# Altium schematic sheet SD.SchDoc
size A4
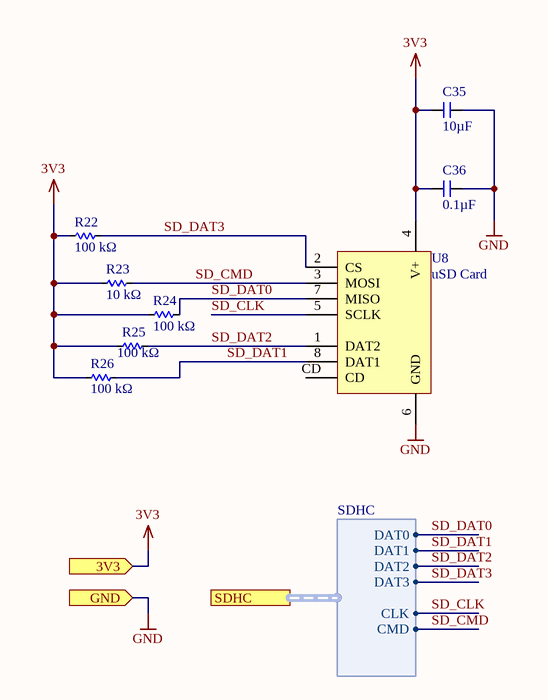
[diagram p0: SD.SchDoc]

## Parts
C35  Capacitance (shorthand): 10µF  [C0603]  (hidden comment: __template_cap)
C36  Capacitance (shorthand): 0.1µF  [C0603]  (hidden comment: __template_cap)
R22  Resistance: 100 kΩ  [R0603]  (hidden comment: __template_resistor)
R23  Resistance: 10 kΩ  [R0603]  (hidden comment: __template_resistor)
R24  Resistance: 100 kΩ  [R0603]  (hidden comment: __template_resistor)
R25  Resistance: 100 kΩ  [R0603]  (hidden comment: __template_resistor)
R26  Resistance: 100 kΩ  [R0603]  (hidden comment: __template_resistor)
U8  uSD Card  [MICROSD_CARD_SOCKET]

## Ports
3V3 (in), GND (in), SDHC (harness SDHC)

## Harnesses
SDHC: DAT3, DAT0, DAT2, DAT1, CLK, CMD

## Nets
3V3: C35.2 C36.1 R22.1 R23.1 R24.1 R25.1 R26.1 U8.4(V+) ; port 3V3
GND: C35.1 C36.2 U8.6(GND) ; port GND
SD_CLK: U8.5(SCLK) ; port SDHC.CLK
SD_CMD: R23.2 U8.3(MOSI) ; port SDHC.CMD
SD_DAT0: R24.2 U8.7(MISO) ; port SDHC.DAT0
SD_DAT1: R26.2 U8.8(DAT1) ; port SDHC.DAT1
SD_DAT2: R25.2 U8.1(DAT2) ; port SDHC.DAT2
SD_DAT3: R22.2 U8.2(CS) ; port SDHC.DAT3

Not connected (* = marked no-connect by the designer): U8 CD

## Notes on the sheet
- Title
- Size:
- Date:
- A4
- Number:
- Time:
- Revision:
- Sheet
- of
- File:

## Library data of the parts
C35 = 490-13248-1-ND: CAP CER 10UF 35V X5R 0603 20%; Manufacturer: Murata Electronics North America; Capacitance - pF (Machine readable): #NAME?; type: capacitor; Rated Voltage: 35V; Dielectric: X5R; Supplier 1: Digikey; Supplier Part Number 1: 490-13248-1-ND
C36 = 490-1519-1-ND: CAP CER 0603 0.1µF X7R 50V 10%; Manufacturer: Murata Electronics North America; Capacitance - pF (Machine readable): #NAME?; type: capacitor; Rated Voltage: 50V; Dielectric: X7R; Supplier 1: Digikey; Supplier Part Number 1: 490-1519-1-ND
R22 R24-R26 = 311-100KHRCT-ND: RES SMD 100K OHM 1% 1/10W 0603; Manufacturer Part Number: RC0603FR-07100KL; Manufacturer: Yageo; Resistance (Sortable): 100000; Power (Watts): 0.1W, 1/10W; Temperature Coefficient: ±100ppm/°C; Supplier 1: Digikey; Datasheets: http://www.yageo.com/documents/recent/PYu-RC_Group_51_RoHS_L_9.pdf; Image: //media.digikey.com/Renders/Yageo%20Renders/0603-(1608-Metric).jpg; Supplier Part Number 1: 311-100KHRCT-ND; Tolerance: ±1%; Operating Temperature: -55°C ~ 155°C
R23 = 311-10.0KHRCT-ND: RES SMD 10K OHM 1% 1/10W 0603; Manufacturer Part Number: RC0603FR-0710KL; Manufacturer: Yageo; Resistance (Sortable): 10000; Power (Watts): 0.1W, 1/10W; Temperature Coefficient: ±100ppm/°C; Supplier 1: Digikey; Datasheets: http://www.yageo.com/documents/recent/PYu-RC_Group_51_RoHS_L_9.pdf; Image: //media.digikey.com/Renders/Yageo%20Renders/0603-(1608-Metric).jpg; Supplier Part Number 1: 311-10.0KHRCT-ND; Tolerance: ±1%; Operating Temperature: -55°C ~ 155°C
U8 = MICRO_SD_CARD_HOLDER: MICROSD CARD HOLDER, PUSH-PUSH; pin to pad: 6>6+SHIELD1+SHIELD2+SHIELD3; Manufacturer: 3M; Manufacturer Part Number: 2908-05WB-MG; Card Type: Secure Digital - microSD™; Number of Positions: 10 (8 + 2); Connector Type: Connector and Ejector; Insertion, Removal Method: Push In, Push Out; Supplier 1: Digi-Key; RoHS: RoHS Compliant; Category: Connectors, Interconnects; Stock 1: 32313; Pricing 1: 1=3.6, 10=3.458, 25=3.1704, 50=3.0262, 100=2.882, 250=2.52176, 500=2.4497, 1000=2.08945 (USD); Packaging: Cut Tape (CT); Ejector Side: -; Mounting Type: Surface Mount, Right Angle; Features: Switch; Height Above Board: 0.073" (1.85mm); Mounting Feature: Normal, Standard - Top; Contact Finish: Gold; Contact Finish Thickness: 15µin (0.38µm); ComponentLink1URL: http://multimedia.3m.com/mws/media/416257O/3mtm-card-connector-microsdtm-2900-series-ts2197.pdf; ComponentLink1Description: http://multimedia.3m.com/mws/media/416257O/3mtm-card-connector-microsdtm-2900-series-ts2197.pdf; Supplier Part Number 1: 3M5607CT-ND